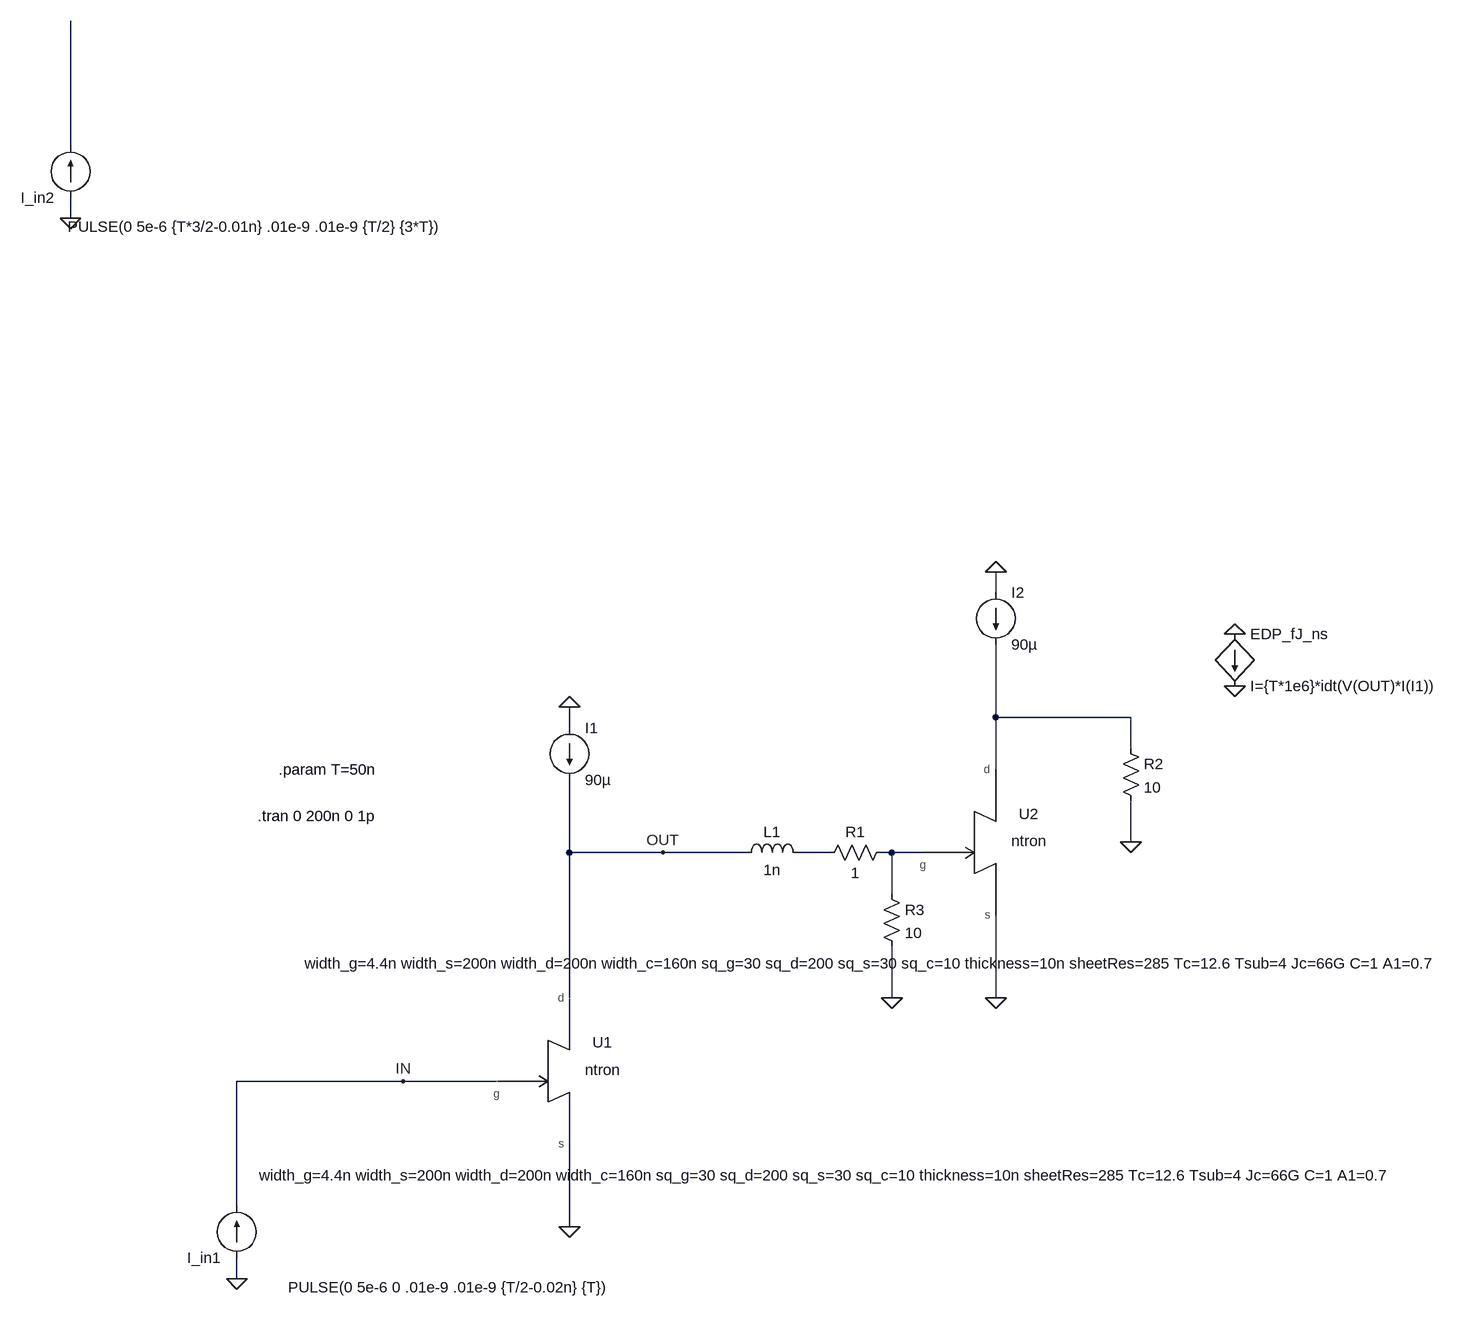
[diagram p0: schematic 2_ntron_EDP_test.asc]
2_ntron_EDP_test.asc, the LTspice schematic file:
Version 4
SHEET 1 2068 832
WIRE -384 -944 -384 -1136
WIRE -384 -832 -384 -864
WIRE 1040 -256 1040 -288
WIRE 1040 -64 1040 -176
WIRE 1248 -64 1040 -64
WIRE 384 -48 384 -80
WIRE 1248 -16 1248 -64
WIRE 1040 16 1040 -64
WIRE 1248 128 1248 64
WIRE 384 144 384 32
WIRE 528 144 384 144
WIRE 656 144 528 144
WIRE 784 144 736 144
WIRE 880 144 864 144
WIRE 928 144 880 144
WIRE 880 208 880 144
WIRE 384 368 384 144
WIRE 880 368 880 288
WIRE 1040 368 1040 240
WIRE 128 496 -128 496
WIRE 272 496 128 496
WIRE -128 688 -128 496
WIRE 384 720 384 592
WIRE -128 800 -128 768
FLAG 384 720 0
FLAG -128 800 0
FLAG 384 -80 0
FLAG 1408 -112 0
FLAG 1408 -192 0
FLAG 128 496 IN
FLAG 528 144 OUT
FLAG -384 -832 0
FLAG 1040 368 0
FLAG 1248 128 0
FLAG 1040 -288 0
FLAG 880 368 0
SYMBOL current -128 768 R180
WINDOW 3 -580 -45 Left 2
WINDOW 123 0 0 Left 2
WINDOW 39 0 0 Left 2
SYMATTR Value PULSE(0 5e-6 0 .01e-9 .01e-9 {T/2-0.02n} {T})
SYMATTR InstName I_in1
SYMBOL current 384 -48 R0
WINDOW 123 0 0 Left 0
WINDOW 39 0 0 Left 0
SYMATTR InstName I1
SYMATTR Value 90µ
SYMBOL bi 1408 -192 R0
SYMATTR InstName EDP_fJ_ns
SYMATTR Value I={T*1e6}*idt(V(OUT)*I(I1))
SYMBOL current -384 -864 R180
WINDOW 3 -580 -45 Left 2
WINDOW 123 0 0 Left 2
WINDOW 39 0 0 Left 2
SYMATTR Value PULSE(0 5e-6 {T*3/2-0.01n} .01e-9 .01e-9 {T/2} {3*T})
SYMATTR InstName I_in2
SYMBOL ntron 384 480 R0
WINDOW 39 405 145 Top 2
SYMATTR SpiceLine width_g=4.4n width_s=200n width_d=200n width_c=160n sq_g=30 sq_d=200 sq_s=30 sq_c=10 thickness=10n sheetRes=285 Tc=12.6 Tsub=4 Jc=66G C=1 A1=0.7
SYMATTR InstName U1
SYMBOL res 1232 -32 R0
SYMATTR InstName R2
SYMATTR Value 10
SYMBOL current 1040 -256 R0
WINDOW 123 0 0 Left 0
WINDOW 39 0 0 Left 0
SYMATTR InstName I2
SYMATTR Value 90µ
SYMBOL ntron 1040 128 R0
WINDOW 39 -181 171 Top 2
SYMATTR SpiceLine width_g=4.4n width_s=200n width_d=200n width_c=160n sq_g=30 sq_d=200 sq_s=30 sq_c=10 thickness=10n sheetRes=285 Tc=12.6 Tsub=4 Jc=66G C=1 A1=0.7
SYMATTR InstName U2
SYMBOL ind 640 160 R270
WINDOW 0 32 56 VTop 2
WINDOW 3 5 56 VBottom 2
SYMATTR InstName L1
SYMATTR Value 1n
SYMBOL res 880 128 R90
WINDOW 0 0 56 VBottom 2
WINDOW 3 32 56 VTop 2
SYMATTR InstName R1
SYMATTR Value 1
SYMBOL res 864 192 R0
SYMATTR InstName R3
SYMATTR Value 10
TEXT -96 88 Left 2 !.tran 0 200n 0 1p
TEXT -64 16 Left 2 !.param T=50n

The netlist it stands for:
* 2_ntron_EDP_test.asc
I_in1 0 IN PULSE(0 5e-6 0 .01e-9 .01e-9 {T/2-0.02n} {T})
I1 0 OUT 90µ
B§EDP_fJ_ns 0 0 I={T*1e6}*idt(V(OUT)*I(I1))
I_in2 0 N001 PULSE(0 5e-6 {T*3/2-0.01n} .01e-9 .01e-9 {T/2} {3*T})
XU1 IN OUT 0 ntron width_g=4.4n width_s=200n width_d=200n width_c=160n sq_g=30 sq_d=200 sq_s=30 sq_c=10 thickness=10n sheetRes=285 Tc=12.6 Tsub=4 Jc=66G C=1 A1=0.7  ; pins g d s
R2 N002 0 10
I2 0 N002 90µ
XU2 N004 N002 0 ntron width_g=4.4n width_s=200n width_d=200n width_c=160n sq_g=30 sq_d=200 sq_s=30 sq_c=10 thickness=10n sheetRes=285 Tc=12.6 Tsub=4 Jc=66G C=1 A1=0.7  ; pins g d s
L1 OUT N003 1n
R1 N004 N003 1
R3 N004 0 10
.tran 0 200n 0 1p
.param T=50n
.lib ntron.lib
.backanno
.end